# Altium schematic sheet 课题设计步进电机.SchDoc
size A4
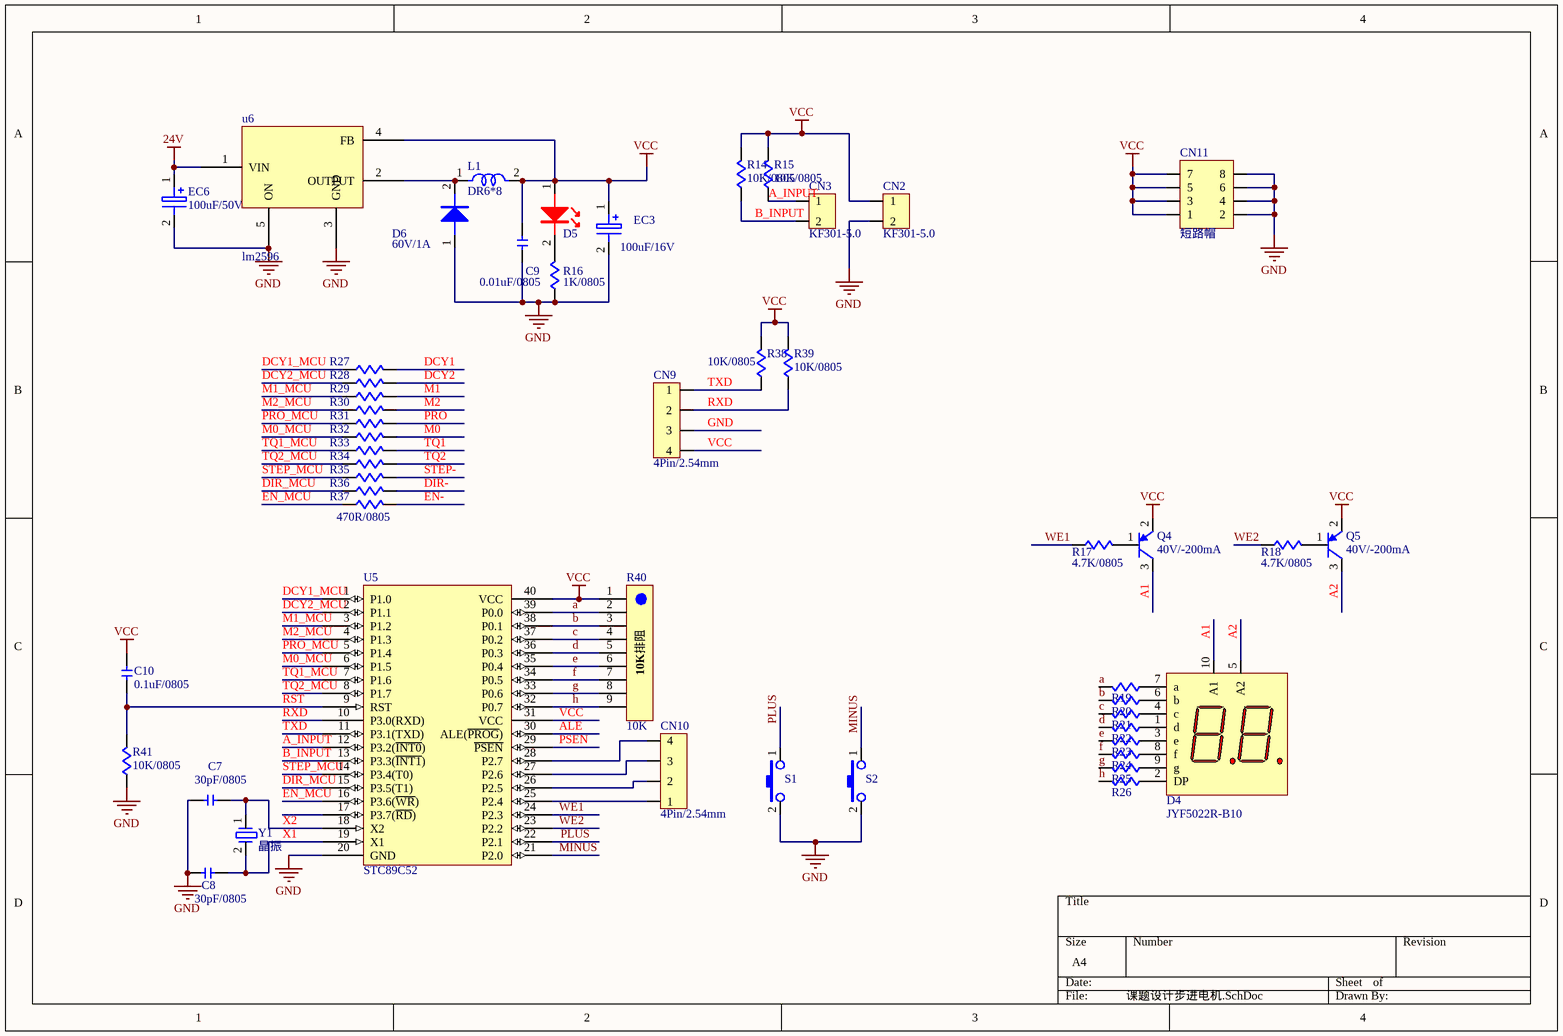
[diagram p0: 课题设计步进电机.SchDoc]

## Parts
C7  30pF/0805  [WSC0805]
C8  30pF/0805  [WSC0805]
C9  0.01uF/0805  [WSC0805]
C10  0.1uF/0805  [WSC0805]
CN2  KF301-5.0  [KF301-5.0]
CN3  KF301-5.0  [KF301-5.0]
CN9  4Pin/2.54mm  [THT-CON4-2.54-2.54A/S-H8.5]
CN10  4Pin/2.54mm  [THT-CON4-2.54-2.54A/S-H8.5]
CN11  短路帽  [THT-CON2*4-2.54-5.08A/D]
D4  JYF5022R-B10  [LED10-2.54*15.24-19A/S-AA]
D5  LED0805  [SD0805]  (value not drawn)
D6  60V/1A  [SDO-214AC(SMA)]
EC3  100uF/16V  [CAPC2-5-5*11A/D]
EC6  100uF/50V  [CAPC2-3.5-8*11.5A/S]
L1  DR6*8  [L2-3-8*11A/S]
Q4  40V/-200mA  [WSOT-23]
Q5  40V/-200mA  [WSOT-23]
R14  10K/0805  [WSR0805]
R15  10K/0805  [WSR0805]
R16  1K/0805  [WSR0805]
R17  4.7K/0805  [WSR0805]
R18  4.7K/0805  [WSR0805]
R19  470R/0805  [WSR0805]  (value not drawn)
R20  470R/0805  [WSR0805]  (value not drawn)
R21  470R/0805  [WSR0805]  (value not drawn)
R22  470R/0805  [WSR0805]  (value not drawn)
R23  470R/0805  [WSR0805]  (value not drawn)
R24  470R/0805  [WSR0805]  (value not drawn)
R25  470R/0805  [WSR0805]  (value not drawn)
R26  470R/0805  [WSR0805]  (value not drawn)
R27  470R/0805  [WSR0805]  (value not drawn)
R28  470R/0805  [WSR0805]  (value not drawn)
R29  470R/0805  [WSR0805]  (value not drawn)
R30  470R/0805  [WSR0805]  (value not drawn)
R31  470R/0805  [WSR0805]  (value not drawn)
R32  470R/0805  [WSR0805]
R33  470R/0805  [WSR0805]  (value not drawn)
R34  470R/0805  [WSR0805]  (value not drawn)
R35  470R/0805  [WSR0805]  (value not drawn)
R36  470R/0805  [WSR0805]  (value not drawn)
R37  470R/0805  [WSR0805]  (value not drawn)
R38  10K/0805  [WSR0805]
R39  10K/0805  [WSR0805]
R40  10K  [R_9*2.54]
R41  10K/0805  [WSR0805]
S1  12VDC/30mA  [THT-SW4-6.5*4.5A/D]  (value not drawn)
S2  12VDC/30mA  [THT-SW4-6.5*4.5A/D]  (value not drawn)
U5  STC89C52  [DIP-40]
u6  lm2596  [TO-220-5L]
Y1  晶振  [HC-49]

## Nets
24V: EC6.1 u6.1(VIN)
GND: C7.1 C8.1 C9.1 CN2.2 CN9.3 CN11.2 CN11.4 CN11.6 CN11.8 D6.1(A) EC3.2 EC6.2 R16.1 R41.1 S1.2 S2.2 U5.20(GND) u6.3(GND) u6.5(ON)
VCC: C9.2 C10.2 CN2.1 CN9.4 CN11.1 CN11.3 CN11.5 CN11.7 D5.1(A) EC3.1 L1.2 Q4.2(E) Q5.2(E) R14.2 R15.2 R38.2 R39.2 R40.1(COM) U5.31(VCC) U5.40(VCC) u6.4(FB)
a: R19.2 R40.2 U5.39(P0.0)
A1: D4.10(A1) Q4.3(C)
A2: D4.5(A2) Q5.3(C)
A_INPUT: CN3.1 R15.1 U5.12(P3.2(~{INT0}))
ALE: U5.30(ALE(~{PROG}))
b: R20.2 R40.3 U5.38(P0.1)
B_INPUT: CN3.2 R14.1 U5.13(P3.3(~{INT1}))
c: R21.2 R40.4 U5.37(P0.2)
d: R22.2 R40.5 U5.36(P0.3)
DCY1: R27.2
DCY1_MCU: R27.1 U5.1(P1.0)
DCY2: R28.2
DCY2_MCU: R28.1 U5.2(P1.1)
DIR-: R36.2
DIR_MCU: R36.1 U5.15(P3.5(T1))
e: R23.2 R40.6 U5.35(P0.4)
EN-: R37.2
EN_MCU: R37.1 U5.16(P3.6(~{WR}))
f: R24.2 R40.7 U5.34(P0.5)
g: R25.2 R40.8 U5.33(P0.6)
h: R26.2 R40.9 U5.32(P0.7)
M0: R32.2
M0_MCU: R32.1 U5.6(P1.5)
M1: R29.2
M1_MCU: R29.1 U5.3(P1.2)
M2: R30.2
M2_MCU: R30.1 U5.4(P1.3)
MINUS: S2.1 U5.21(P2.0)
PLUS: S1.1 U5.22(P2.1)
PRO: R31.2
PRO_MCU: R31.1 U5.5(P1.4)
PSEN: U5.29(~{PSEN})
RST: C10.1 R41.2 U5.9(RST)
RXD: CN9.2 R39.1 U5.10(P3.0(RXD))
STEP-: R35.2
STEP_MCU: R35.1 U5.14(P3.4(T0))
TQ1: R33.2
TQ1_MCU: R33.1 U5.7(P1.6)
TQ2: R34.2
TQ2_MCU: R34.1 U5.8(P1.7)
TXD: CN9.1 R38.1 U5.11(P3.1(TXD))
WE1: R17.1 U5.24(P2.3)
WE2: R18.1 U5.23(P2.2)
X1: C8.2 U5.19(X1) Y1.2
X2: C7.2 U5.18(X2) Y1.1
NetCN10_1: CN10.1 U5.25(P2.4)
NetCN10_2: CN10.2 U5.26(P2.5)
NetCN10_3: CN10.3 U5.27(P2.6)
NetCN10_4: CN10.4 U5.28(P2.7)
NetD4_1: D4.1(d) R22.1
NetD4_2: D4.2(DP) R26.1
NetD4_3: D4.3(e) R23.1
NetD4_4: D4.4(c) R21.1
NetD4_6: D4.6(b) R20.1
NetD4_7: D4.7(a) R19.1
NetD4_8: D4.8(f) R24.1
NetD4_9: D4.9(g) R25.1
NetD5_2: D5.2(K) R16.2
NetD6_2: D6.2(K) L1.1 u6.2(OUTPUT)
NetQ4_1: Q4.1(B) R17.2
NetQ5_1: Q5.1(B) R18.2

Not connected (* = marked no-connect by the designer): U5 17(P3.7(~{RD}))

## Notes on the sheet
- (in symbol 插件排阻) 10K排阻

## Library data of the parts
C7 C8 = R21080010: R21080010/工业C/消费C/贴片电容/30pF±5%/50V/NPO/0805; 装配类型: SMD; 物料编码: R21080010; 物料描述: 贴片电容/30pF±5%/50V/NPO/0805; 优选等级: 工业C/消费C
C9 = R21050097: R21050097/工业C/消费C/贴片电容/0.01uF±5%/50V/NPO/0805; 装配类型: SMD; 物料编码: R21050097; 物料描述: 贴片电容/0.01uF±5%/50V/NPO/0805; 优选等级: 工业C/消费C
C10 = R21050005: R21050005/工业B/消费B/贴片电容/0.1uF±10%/50V/X7R/0805; 装配类型: SMD; 物料编码: R21050005; 物料描述: 贴片电容/0.1uF±10%/50V/X7R/0805; 优选等级: 工业B/消费B
CN9 CN10 = R30041122: R30041122/消费B/普通插座/单排排母/4PIN/3A/单排/直脚/鱼叉母座/2.54mm/-40~105℃/H=8.5mm; 优选等级: 消费B; 装配类型: THT; 物料描述: 普通插座/单排排母/4PIN/3A/单排/直脚/鱼叉母座/2.54mm/-40~105℃/H=8.5mm; 物料编码: R30041122
CN11 = 2*54Pin/2.54mm
D4 = R26010188: R26010188/消费C/数码管/2位/共阳/红色630nm/40mcd/25*19*8mm/无铅; 优选等级: 消费C; 装配类型: THT; 物料描述: 数码管/2位/共阳/红色630nm/40mcd/25*19*8mm/无铅; 物料编码: R26010188
D5 = R26010108: R26010108/工业A/消费A/发光二极管/红色/61mcd@20mA/0805SMD/LED0805; 装配类型: SMD; 物料描述: 发光二极管/红色/61mcd@20mA/0805SMD; 物料编码: R26010108; 优选等级: 工业A/消费A
D6 = R26030097: R26030097/工业C/肖特基二极管/60V/1A/0.70V/SMA/B160; 优选等级: 工业C; 装配类型: SMD; 物料描述: 肖特基二极管/60V/1A/0.70V/SMA; 物料编码: R26030097
EC3 = R21010764: R21010764/消费C/铝电解电容/105℃/100uF/16V/φ5*11; 优选等级: 消费C; 装配类型: THT; 物料编码: R21010764; 物料描述: 铝电解电容/105℃/100uF/16V/φ5*11
EC6 = R21010695: R21010695/消费C/电解电容/105℃/100uF/50v/φ8*11.5/引脚间距3.5mm; 优选等级: 消费C; 装配类型: THT; 物料编码: R21010695; 物料描述: 电解电容/105℃/100uF/50v/φ8*11.5/引脚间距3.5mm
L1 = R22011019: R22011019/消费A/工字型电感DR6*8/100uH/MC1600-L3; 优选等级: 消费A; 装配类型: THT; 物料编码: R22011019; 物料描述: 工字型电感DR6*8/100uH/MC1600-L3
Q4 Q5 = R26080002: R26080002/工业A/消费A/小信号三极管/PNP/-40V/-200mA/SOT-23; 装配类型: SMD; 物料编码: R26080002; 物料描述: 小信号三极管/PNP/-40V/-200mA/SOT-23; 优选等级: 工业A/消费A
R14 R15 R38 R39 R41 = R20180048: R20180048/工业A/消费A/贴片电阻/1/8W/10KΩ±5%/0805; 装配类型: SMD; 物料编码: R20180048; 物料描述: 贴片电阻/1/8W/10KΩ±5%/0805; 优选等级: 工业A/消费A
R16 = R20180023: R20180023/工业A/消费A/贴片电阻/1/8W/1KΩ±5%/0805; 装配类型: SMD; 物料编码: R20180023; 物料描述: 贴片电阻/1/8W/1KΩ±5%/0805; 优选等级: 工业A/消费A
R17 R18 = R20180039: R20180039/工业A/消费A/贴片电阻/1/8W/4.7KΩ±5%/0805; 装配类型: SMD; 物料编码: R20180039; 物料描述: 贴片电阻/1/8W/4.7KΩ±5%/0805; 优选等级: 工业A/消费A
R19-R26 = R20180017: R20180017/工业A/消费A/贴片电阻/1/8W/470Ω±5%/0805; 装配类型: SMD; 物料编码: R20180017; 物料描述: 贴片电阻/1/8W/470Ω±5%/0805; 优选等级: 工业A/消费A
R27-R37 = R20180245: R20180245/工业C/消费C/贴片电阻/1/8W/470Ω±1%/0805/ROHS; 装配类型: SMD; 物料编码: R20180245; 物料描述: 贴片电阻/1/8W/470Ω±1%/0805/ROHS; 优选等级: 工业C/消费C
R40 = 插件排阻
S1 S2 = R34010007: R34010007/消费A/微动开关/12VDC/30mA/6*6*4.3mm/插件; 优选等级: 消费A; 装配类型: THT; 物料编码: R34010007; 物料描述: 微动开关/12VDC/30mA/6*6*4.3mm/插件
U5 = AT89C51